# EAGLE design CBV2 (EAGLE 7.6.0)
COMPANY: ADAFRUIT INDUSTRIES; DRAWN: KTOWN; REV: B
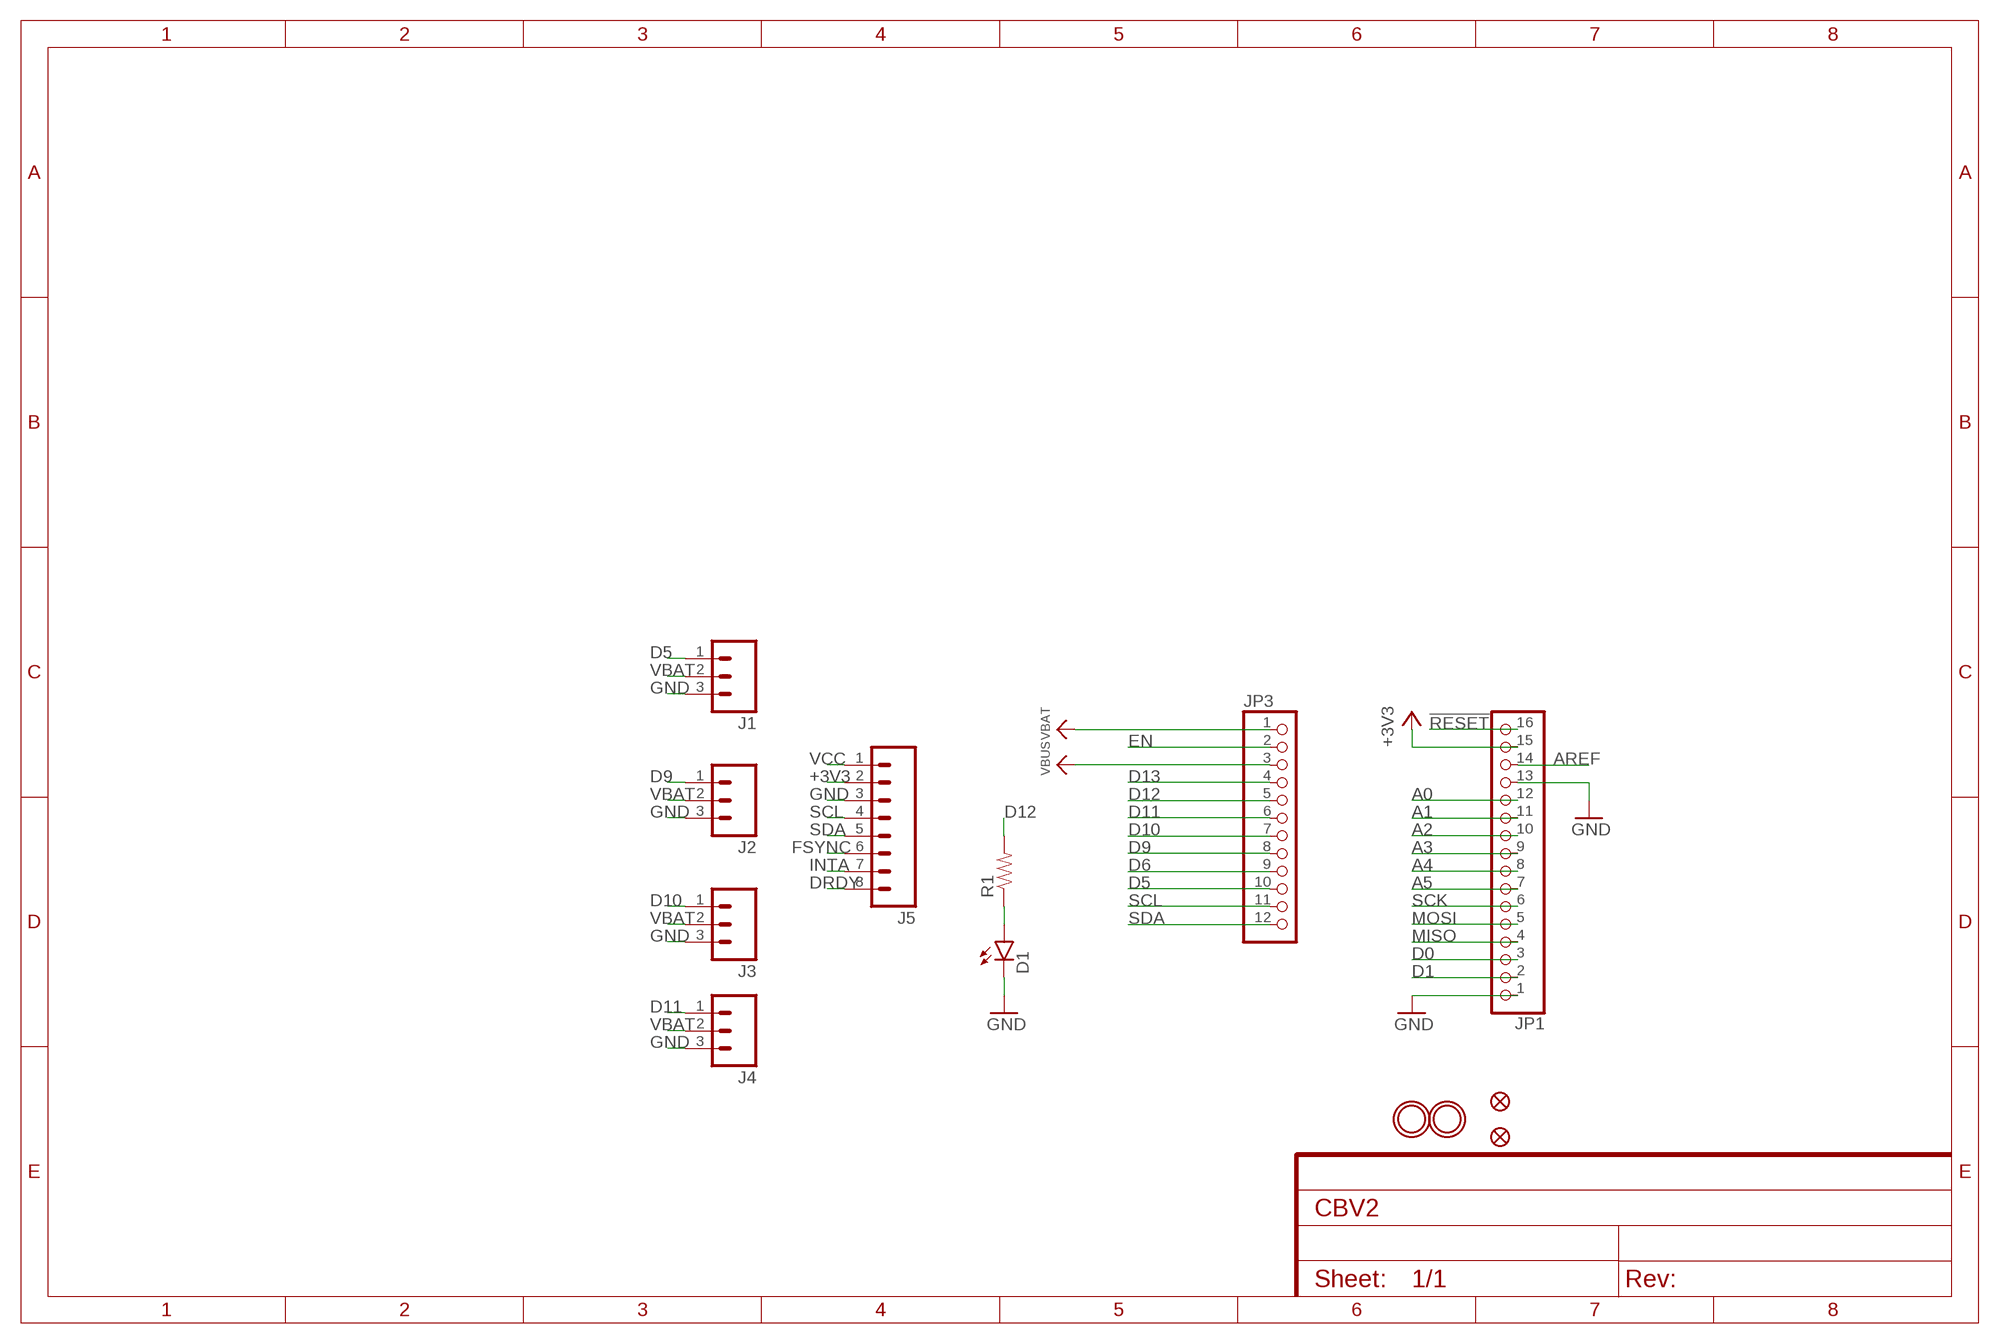
[diagram p0: schematic, sheet 1]

## Parts
D1  LED3MM  [LED3MM]
J1  M03PTH  [1X03]
J2  M03PTH  [1X03]
J3  M03PTH  [1X03]
J4  M03PTH  [1X03]
J5  M08  [1X08_ROUND]
JP1  HEADER-1X16ROUND  [1X16_ROUND]
JP3  HEADER-1X12  [1X12_ROUND]
R1  RESISTORPTH-1/4W  [AXIAL-0.4]
U$31  MOUNTINGHOLE2.5  [MOUNTINGHOLE_2.5_PLATED]
U$32  MOUNTINGHOLE2.5  [MOUNTINGHOLE_2.5_PLATED]
U$34  FIDUCIAL""  [FIDUCIAL_1MM]
U$35  FIDUCIAL""  [FIDUCIAL_1MM]

## Nets
!RESET: JP1.16
+3V3: J5.2 JP1.15
A0: JP1.12
A1: JP1.11
A2: JP1.10
A3: JP1.9
A4: JP1.8
A5: JP1.7
AREF: JP1.14
D0: JP1.3
D1: JP1.2
D5: J1.1 JP3.10
D6: JP3.9
D9: J2.1 JP3.8
D10: J3.1 JP3.7
D11: J4.1 JP3.6
D12: JP3.5 R1.P$2
D13: JP3.4
DRDY: J5.8
EN: JP3.2
FSYNC: J5.6
GND: D1.K(C) J1.3 J2.3 J3.3 J4.3 J5.3 JP1.1 JP1.13
INTA: J5.7
MISO: JP1.4
MOSI: JP1.5
N$1: D1.A R1.P$1
SCK: JP1.6
SCL: J5.4 JP3.11
SDA: J5.5 JP3.12
VBAT: J1.2 J2.2 J3.2 J4.2 JP3.1
VBUS: JP3.3
VCC: J5.1

## Library data of the parts
D1 = SparkFun-LED:LED: LEDs Standard schematic elements and footprints for 5mm, 3mm, 1206, and 0603 sized LEDs. 5mm - Spark Fun Electronics SKU : COM-00529 (and others); PROD_ID: DIO-08794
J1-J4 = SparkFun-Connectors:M03: Header 3 Standard 3-pin 0.1" header. Use with straight break away headers (SKU : PRT-00116), right angle break away headers (PRT-00553), swiss pins (PRT-00743), machine pins (PRT-00117), and female headers (PRT-00115). Molex polarized connector foot print use with SKU : PRT-08232 with associated crimp pins and housings.
J5 = SparkFun-Connectors:M08: Header 8 Standard 8-pin 0.1" header. Use with straight break away headers (SKU : PRT-00116), right angle break away headers (PRT-00553), swiss pins (PRT-00743), machine pins (PRT-00117), and female headers (PRT-00115).; PROD_ID: CONN-08437
JP1 = microbuilder:HEADER-1X16: PIN HEADER
JP3 = microbuilder:HEADER-1X12
R1 = SparkFun-Resistors:RESISTOR: Resistor Basic schematic elements and footprints for 0603, 1206, and PTH resistors.
U$31 U$32 = microbuilder:MOUNTINGHOLE: Mounting Hole For #2 screws (0.086"/2.18mm width, 0.094"/2.4mm hole) use 2.5mm; BOM: EXCLUDE
U$34 U$35 = microbuilder:FIDUCIAL: Fiducial Alignment Points Various fiducial points for machine vision alignment.; BOM: EXCLUDE

## Board
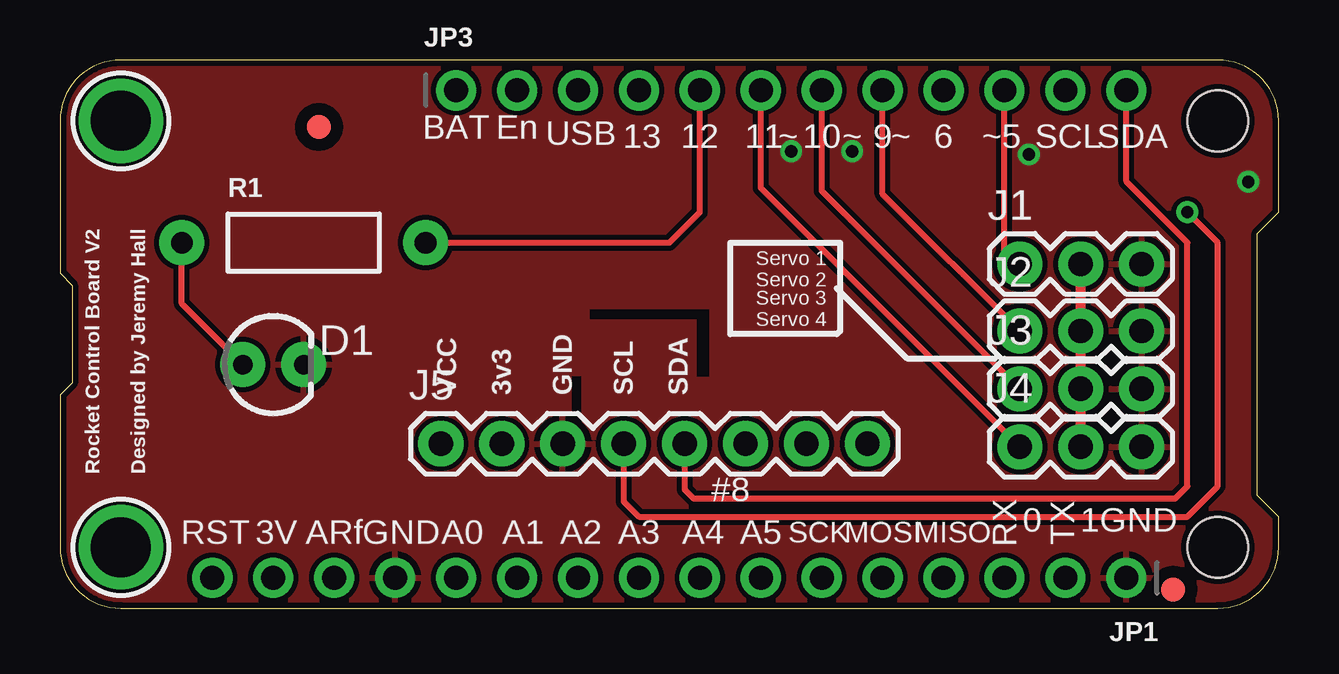
[diagram p1: board, top side]
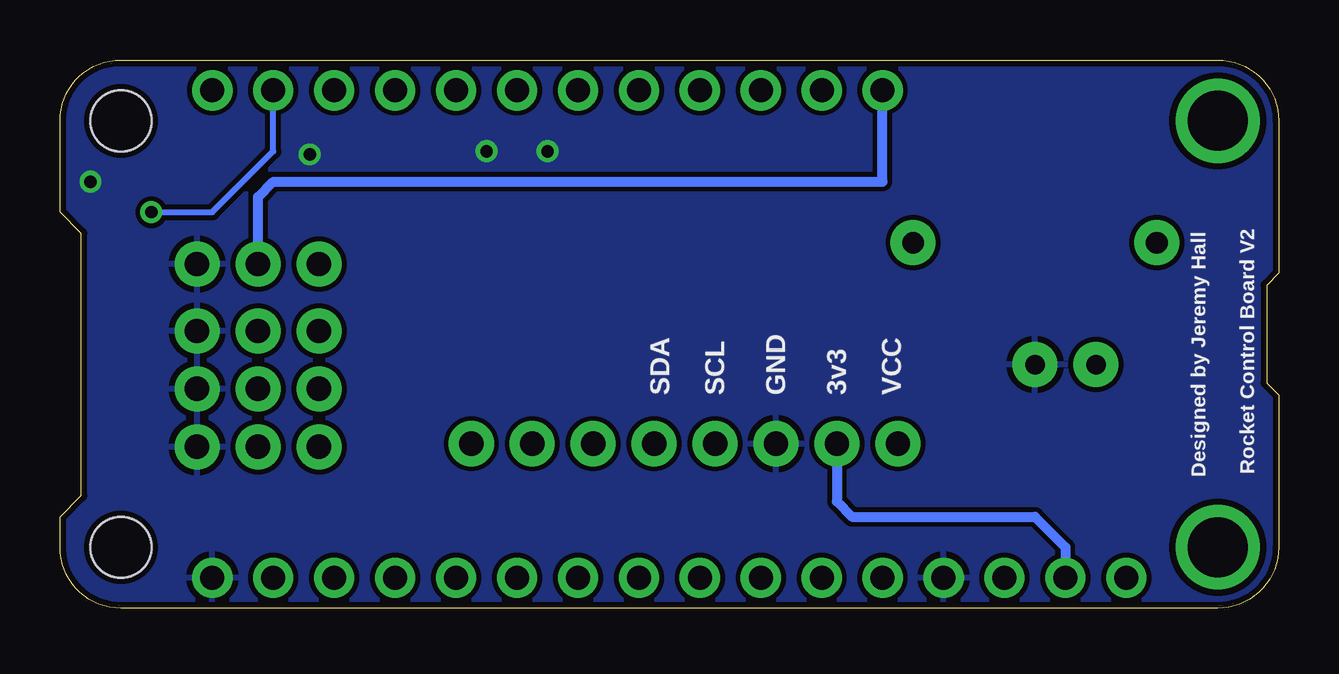
[diagram p2: board, bottom side, seen from below]

Size 50.8 x 22.86 mm. Coordinates in mm from the lower left corner, seen from the top.
Outline: 2.54,0 48.26,0 arc90 50.8,2.54 50.8,3.81 49.91,4.7 49.91,15.62 50.8,16.51 50.8,20.32 arc90 48.26,22.86 2.54,22.86 arc90 0,20.32 0,13.97 0.51,13.46 0.51,9.4 0,8.89 0,2.54 arc90 2.54,0
Copper layers (1*16): Top 0.035mm / dielectric 1.5mm / Bottom 0.035mm
Design rules "adafruit *": minimum track width 8mil, minimum drill 15.5mil, track to track 8mil, track to pad 8mil, pad to pad 8mil, via to via 8mil, smd to smd 8mil, copper to edge 10mil, drill to drill 8mil, minimum pad ring 10mil, minimum via ring 8mil, stop-mask expansion 2mil, vias tented up to drill 20mil, thermal gap 10mil
Holes 2.54 mm at 48.26,20.32 48.26,2.54
tRestrict: area 21.3,6.9 to 21.7,9.7; area 22.1,12.1 to 27.1,12.4; area 26.5,9.7 to 27.1,12.2

### Footprints (pad centres in the part's own frame; a part is rotated, then mirrored left to right if it is on the bottom)
LED3MM = drill 0.813 pad 1.88: A -1.27,0; K 1.27,0
1X03 = drill 1.016 pad 1.88: 1 0,0; 2 2.54,0; 3 5.08,0
1X08_ROUND = drill 1.016 pad 1.88: 1 0,0; 2 2.54,0; 3 5.08,0; 4 7.62,0; 5 10.16,0; 6 12.7,0; 7 15.24,0; 8 17.78,0
1X16_ROUND = drill 1 pad 1.676: 1 -19.05,0; 2 -16.51,0; 3 -13.97,0; 4 -11.43,0; 5 -8.89,0; 6 -6.35,0; 7 -3.81,0; 8 -1.27,0; 9 1.27,0; 10 3.81,0; 11 6.35,0; 12 8.89,0; 13 11.43,0; 14 13.97,0; 15 16.51,0; 16 19.05,0
1X12_ROUND = drill 1 pad 1.676: 1 -13.97,0; 2 -11.43,0; 3 -8.89,0; 4 -6.35,0; 5 -3.81,0; 6 -1.27,0; 7 1.27,0; 8 3.81,0; 9 6.35,0; 10 8.89,0; 11 11.43,0; 12 13.97,0
AXIAL-0.4 = drill 0.9 pad 1.88: P$1 -5.08,0; P$2 5.08,0
MOUNTINGHOLE_2.5_PLATED = drill 2.5 pad 3.2: P$1 0,0
FIDUCIAL_1MM = smd 1 x 1: 1 0,0

### Placement (x,y rotation side)
D1  8.89,10.16 0 top
J1  40.01,14.35 0 top
J2  40.01,11.56 0 top
J3  40.01,9.14 0 top
J4  40.01,6.73 0 top
J5  15.88,6.86 0 top
JP1  25.4,1.27 180 top
JP3  30.48,21.59 0 top
R1  10.16,15.24 0 top
U$31  2.54,20.32 270 top
U$32  2.54,2.54 270 top
U$34  10.79,20.07 270 top
U$35  46.4,0.77 270 top

### Tracks (layer width: path | path; a pad name or v marks a point on that pad's centre or on a via)
+3V3
  Bottom 0.406: J5.2 18.41,4.45 17.78,3.81 10.16,3.81 8.89,2.54 JP1.15
D5
  Top 0.254: J1.1 39.37,14.35 JP3.10
D9
  Top 0.254: J2.1 34.29,17.27 JP3.8
D10
  Top 0.254: J3.1 31.75,17.4 JP3.7
D11
  Top 0.254: J4.1 29.21,17.53 JP3.6
D12
  Top 0.254: R1.P$2 25.4,15.24 26.67,16.51 JP3.5
GND  (via drill 0.51)
  other vias: 49.53,17.78 30.48,19.05 33.02,19.05 40.39,18.92
  pour Top: 0,22.86 0,0 50.93,-0.13 50.93,22.73
  pour Bottom: 50.93,0 0,0 0,22.86 50.93,22.86
N$1
  Top 0.254: D1.A 5.08,12.7 R1.P$1
SCL  (via drill 0.51)
  Top 0.254: J5.4 23.5,4.45 24.13,3.81 46.99,3.81 48.26,5.08 48.26,15.24 v46.99,16.51
  Bottom 0.254: v46.99,16.51 44.45,16.51 41.91,19.05 JP3.11
SDA
  Top 0.254: J5.5 26.04,4.95 26.42,4.57 46.48,4.57 46.99,5.08 46.99,15.24 44.45,17.78 JP3.12
VBAT
  Top 0.406: J4.2 J3.2 J2.2 J1.2
  Bottom 0.406: J1.2 42.55,17.14 41.91,17.78 16.51,17.78 JP3.1

### Text on the board
tPlace: BAT | En | USB | 13 | 12 | 11 | ~ | 10 | ~ | 9 | ~ | 6 | ~5 | SCL | SDA | Servo 1 | Servo 2 | Servo 3 | Servo 4 | VCC | 3v3 | GND | SCL | SDA | Rocket Control Board V2 | Designed by Jeremy Hall | #8 | RX | 0 | TX | 1 | GND | RST | 3V | ARf | GND | A0 | A1 | A2 | A3 | A4 | A5 | SCK | MOSI | MISO
bPlace: VCC | 3v3 | GND | SCL | SDA | Rocket Control Board V2 | Designed by Jeremy Hall